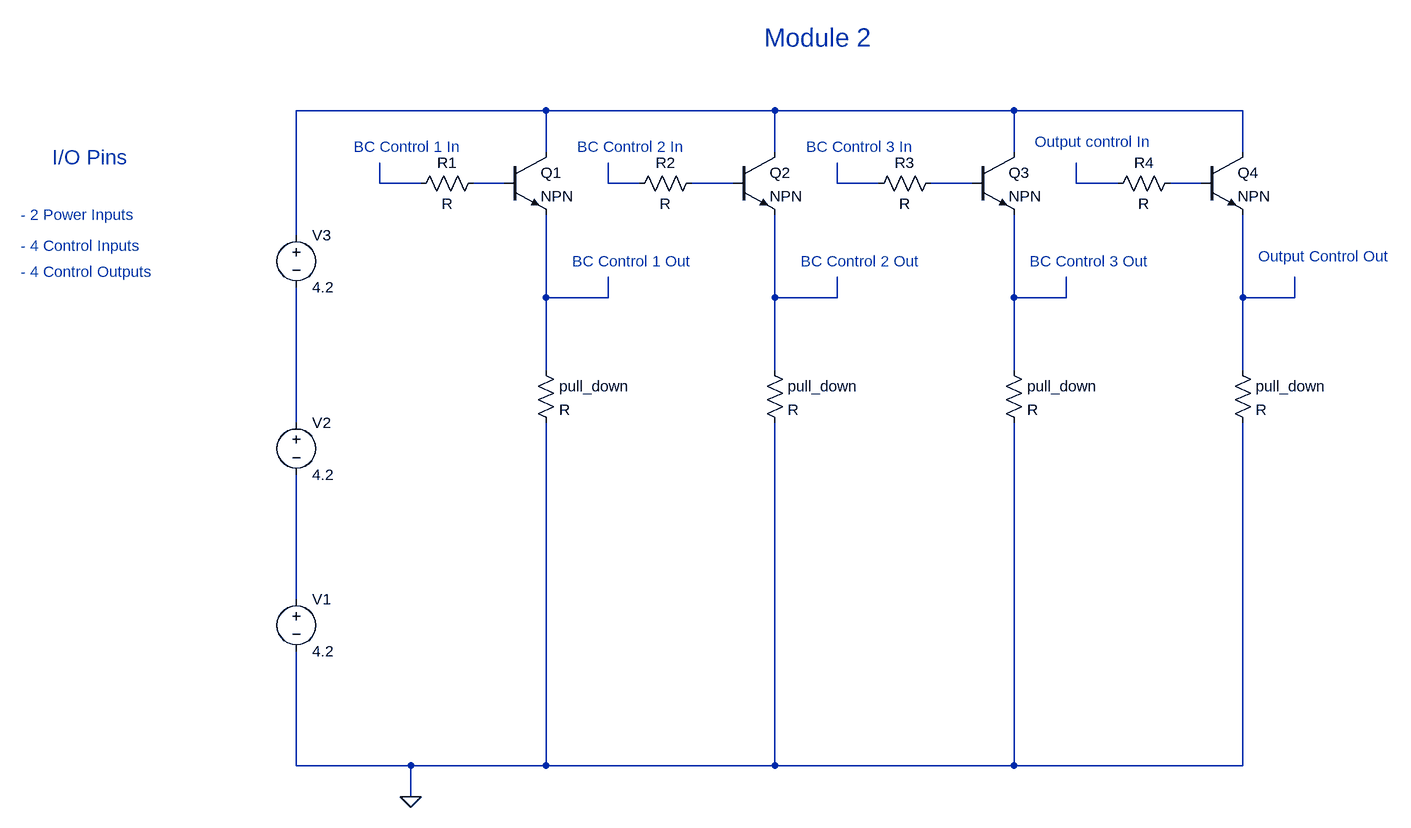
[diagram p0: schematic Module 2 - A(Driver 1).asc]
Module 2 - A(Driver 1).asc, the LTspice schematic file:
Version 4
SHEET 1 1928 680
WIRE 608 -448 224 -448
WIRE 960 -448 608 -448
WIRE 1328 -448 960 -448
WIRE 1680 -448 1328 -448
WIRE 608 -384 608 -448
WIRE 960 -384 960 -448
WIRE 1328 -384 1328 -448
WIRE 1680 -384 1680 -448
WIRE 352 -336 352 -368
WIRE 416 -336 352 -336
WIRE 544 -336 496 -336
WIRE 704 -336 704 -368
WIRE 752 -336 704 -336
WIRE 896 -336 832 -336
WIRE 1056 -336 1056 -368
WIRE 1120 -336 1056 -336
WIRE 1264 -336 1200 -336
WIRE 1424 -336 1424 -368
WIRE 1488 -336 1424 -336
WIRE 1616 -336 1568 -336
WIRE 224 -256 224 -448
WIRE 608 -160 608 -288
WIRE 704 -160 704 -192
WIRE 704 -160 608 -160
WIRE 960 -160 960 -288
WIRE 1056 -160 1056 -192
WIRE 1056 -160 960 -160
WIRE 1328 -160 1328 -288
WIRE 1408 -160 1408 -192
WIRE 1408 -160 1328 -160
WIRE 1680 -160 1680 -288
WIRE 1760 -160 1760 -192
WIRE 1760 -160 1680 -160
WIRE 608 -48 608 -160
WIRE 960 -48 960 -160
WIRE 1328 -48 1328 -160
WIRE 1680 -48 1680 -160
WIRE 224 32 224 -176
WIRE 224 304 224 112
WIRE 224 560 224 384
WIRE 400 560 224 560
WIRE 608 560 608 32
WIRE 608 560 400 560
WIRE 960 560 960 32
WIRE 960 560 608 560
WIRE 1328 560 1328 32
WIRE 1328 560 960 560
WIRE 1680 560 1680 32
WIRE 1680 560 1328 560
WIRE 400 608 400 560
FLAG 400 608 0
SYMBOL voltage 224 288 R0
WINDOW 123 0 0 Left 0
WINDOW 39 0 0 Left 0
SYMATTR InstName V1
SYMATTR Value 4.2
SYMBOL voltage 224 16 R0
WINDOW 123 0 0 Left 0
WINDOW 39 0 0 Left 0
SYMATTR InstName V2
SYMATTR Value 4.2
SYMBOL voltage 224 -272 R0
WINDOW 123 0 0 Left 0
WINDOW 39 0 0 Left 0
SYMATTR InstName V3
SYMATTR Value 4.2
SYMBOL npn 544 -384 R0
SYMATTR InstName Q1
SYMBOL npn 896 -384 R0
SYMATTR InstName Q2
SYMBOL npn 1264 -384 R0
SYMATTR InstName Q3
SYMBOL npn 1616 -384 R0
SYMATTR InstName Q4
SYMBOL res 512 -352 R90
WINDOW 0 0 56 VBottom 2
WINDOW 3 32 56 VTop 2
SYMATTR InstName R1
SYMBOL res 848 -352 R90
WINDOW 0 0 56 VBottom 2
WINDOW 3 32 56 VTop 2
SYMATTR InstName R2
SYMBOL res 1216 -352 R90
WINDOW 0 0 56 VBottom 2
WINDOW 3 32 56 VTop 2
SYMATTR InstName R3
SYMBOL res 1584 -352 R90
WINDOW 0 0 56 VBottom 2
WINDOW 3 32 56 VTop 2
SYMATTR InstName R4
SYMBOL res 592 -64 R0
SYMATTR InstName pull_down
SYMBOL res 944 -64 R0
SYMATTR InstName pull_down
SYMBOL res 1312 -64 R0
SYMATTR InstName pull_down
SYMBOL res 1664 -64 R0
SYMATTR InstName pull_down
TEXT 312 -392 Left 2 ;BC Control 1 In
TEXT 656 -392 Left 2 ;BC Control 2 In
TEXT 1008 -392 Left 2 ;BC Control 3 In
TEXT 1360 -400 Left 2 ;Output control In
TEXT 648 -216 Left 2 ;BC Control 1 Out
TEXT 1000 -216 Left 2 ;BC Control 2 Out
TEXT 1352 -216 Left 2 ;BC Control 3 Out
TEXT 1704 -224 Left 2 ;Output Control Out
TEXT 944 -560 Left 4 ;Module 2
TEXT -152 -376 Left 3 ;I/O Pins
TEXT -200 -288 Left 2 ;- 2 Power Inputs
TEXT -200 -240 Left 2 ;- 4 Control Inputs
TEXT -200 -200 Left 2 ;- 4 Control Outputs

The netlist it stands for:
* Module 2 - A(Driver 1).asc
V1 N015 0 4.2
V2 N014 N015 4.2
V3 N001 N014 4.2
Q1 N001 N003 N010 0 NPN
Q2 N001 N005 N011 0 NPN
Q3 N001 N007 N012 0 NPN
Q4 N001 N009 N013 0 NPN
R1 N003 N002 R
R2 N005 N004 R
R3 N007 N006 R
R4 N009 N008 R
R§pull_down N010 0 R
R§pull_down N011 0 R
R§pull_down N012 0 R
R§pull_down N013 0 R
.model NPN NPN
.model PNP PNP
.lib standard.bjt
* BC Control 1 In
* BC Control 2 In
* BC Control 3 In
* Output control In
* BC Control 1 Out
* BC Control 2 Out
* BC Control 3 Out
* Output Control Out
* Module 2
* I/O Pins
* - 2 Power Inputs
* - 4 Control Inputs
* - 4 Control Outputs
.backanno
.end